# Altium project OPENFV 1.0.PrjPcb
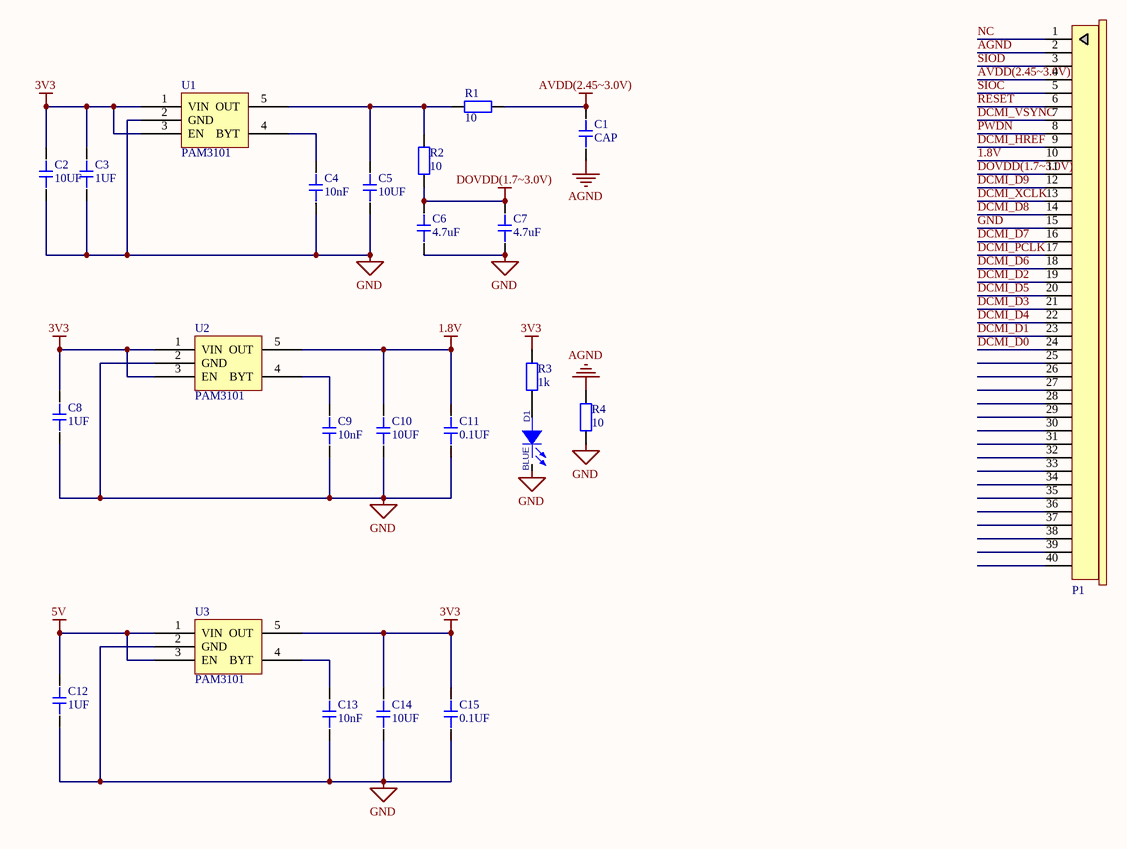
[diagram p0: ov7670电路（骑飞）.SchDoc]
2 sheets, 63 parts. Net scope: global (net labels, ports and power ports of the same name join across sheets).
Board file: 1.0.PcbDoc
Sheets:
  ov7670电路（骑飞）.SchDoc
  F407VET6（主控）.SchDoc

## Sheet ov7670电路（骑飞）.SchDoc
size A4

### Parts
C1  CAP  [C_0603]
C2  10UF  [C_0805]
C3  1UF  [C_0603]
C4  10nF  [C_0603]
C5  10UF  [C_0805]
C6  4.7uF  [C_0805]
C7  4.7uF  [C_0603]
C8  1UF  [C_0603]
C9  10nF  [C_0603]
C10  10UF  [C_0805]
C11  0.1UF  [C_0603]
C12  1UF  [C_0603]
C13  10nF  [C_0603]
C14  10UF  [C_0805]
C15  0.1UF  [C_0603]
D1  value BLUE  [LED_0603]  (hidden comment: LED)
P1  FPC  [FPC0.5-40P-A]  (value not drawn)
R1  value 10  [0603-1]  (hidden comment: Res1)
R2  value 10  [0603-1]  (hidden comment: Res1)
R3  value 1k  [0603-1]  (hidden comment: Res1)
R4  value 10  [0603-1]  (hidden comment: Res1)
U1  PAM3101  [SOT23-5]
U2  PAM3101  [SOT23-5]
U3  PAM3101  [SOT23-5]

### Nets
1.8V: C10.2 C11.2 P1.10 U2.5(OUT)
3V3: C2.2 C3.2 C8.2 C14.2 C15.2 R3.2 U1.1(VIN) U1.3(EN) U2.1(VIN) U2.3(EN) U3.5(OUT)
5V: C12.2 U3.1(VIN) U3.3(EN)
AGND: C1.1 P1.2 R4.2
AVDD(2.45~3.0V): C1.2 P1.4 R1.2
DOVDD(1.7~3.0V): C6.2 C7.2 P1.11 R2.1
GND: C2.1 C3.1 C4.1 C5.1 C6.1 C7.1 C8.1 C9.1 C10.1 C11.1 C12.1 C13.1 C14.1 C15.1 D1.2(CATHODE) P1.15 R4.1 U1.2(GND) U2.2(GND) U3.2(GND)
DCMI_D0: P1.24
DCMI_D1: P1.23
DCMI_D2: P1.19
DCMI_D3: P1.21
DCMI_D4: P1.22
DCMI_D5: P1.20
DCMI_D6: P1.18
DCMI_D7: P1.16
DCMI_D8: P1.14
DCMI_D9: P1.12
DCMI_HREF: P1.9
DCMI_PCLK: P1.17
DCMI_VSYNC: P1.7
DCMI_XCLK: P1.13
NC: P1.1
PWDN: P1.8
RESET: P1.6
SIOC: P1.5
SIOD: P1.3
NetC4_2: C4.2 U1.4(BYT)
NetC5_2: C5.2 R1.1 R2.2 U1.5(OUT)
NetC9_2: C9.2 U2.4(BYT)
NetC13_2: C13.2 U3.4(BYT)
NetD1_1: D1.1(ANODE) R3.1

Not connected (* = marked no-connect by the designer): P1 25 26 27 28 29 30 31 32 33 34 35 36 37 38 39 40

### Library data of the parts
C2-C15 = CAP
P1 = FPC-40P: FPC排线连接器
R1-R4 = Res1: 贴片电阻; Published: 8-Jun-2000; LatestRevisionDate: 17-Jul-2002; LatestRevisionNote: Re-released for DXP Platform.; PackageReference: AXIAL-0.4; Publisher: Altium Limited
U1-U3 = PAM3101: LDO
D1 = LED: PCB DECAL: LED_0603

## Sheet F407VET6（主控）.SchDoc
size A4
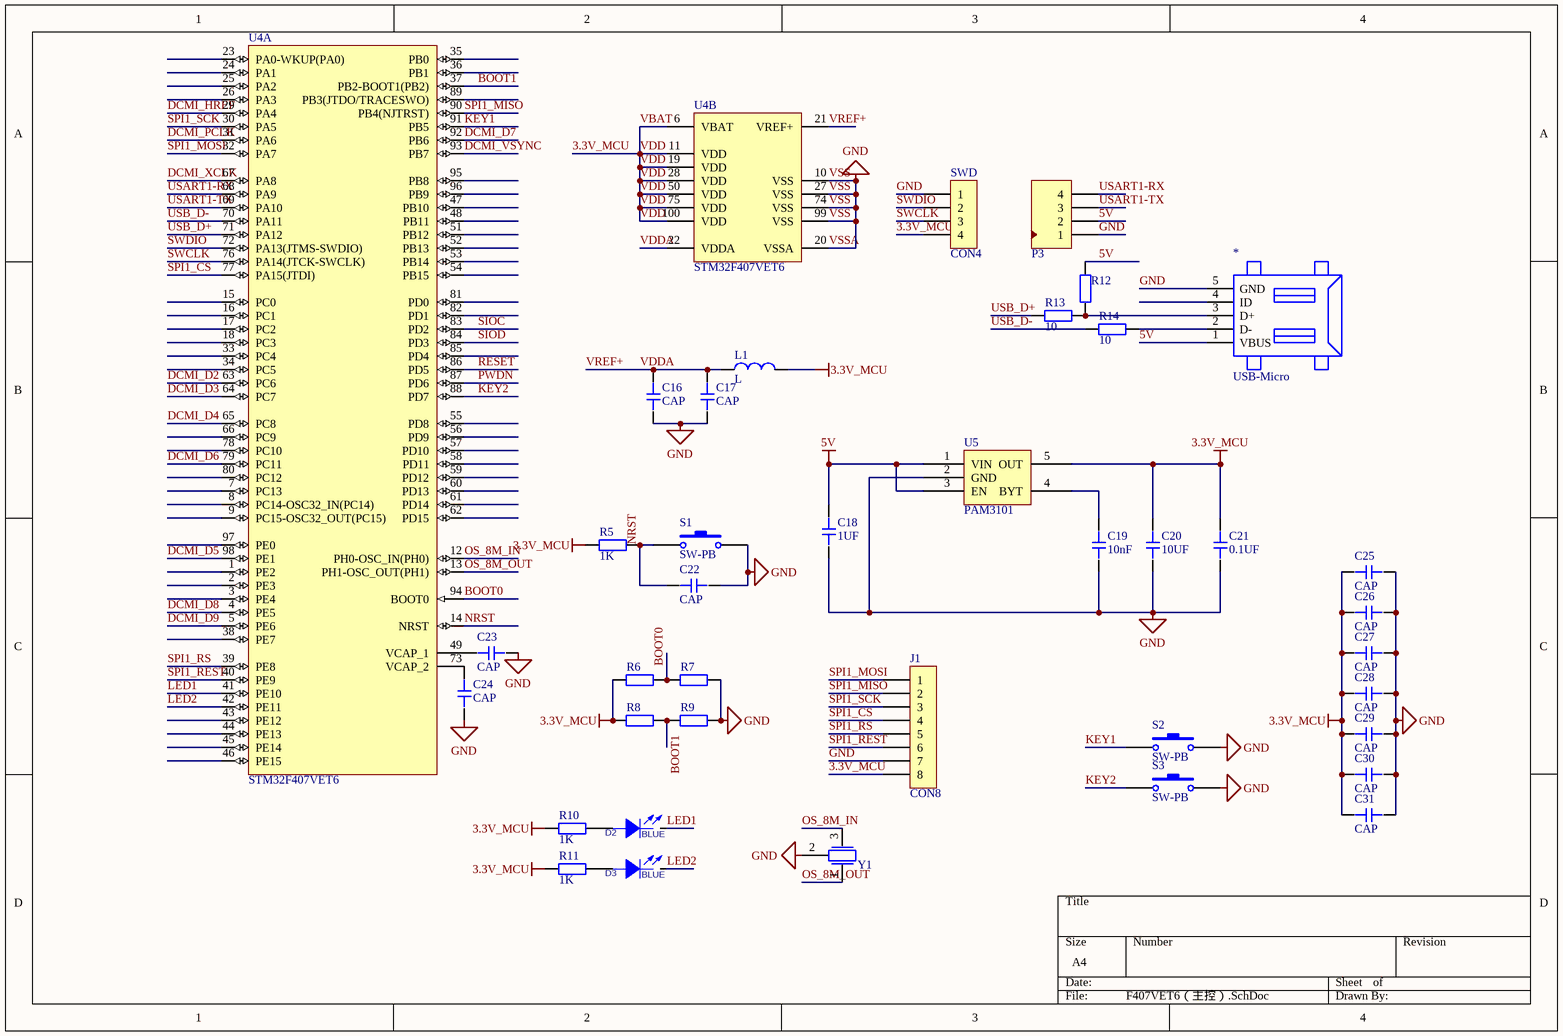
[diagram p1: F407VET6（主控）.SchDoc]

### Parts
*  USB-Micro  [USB-Micro]
C16  CAP  [C_0603]
C17  CAP  [C_0603]
C18  1UF  [C_0603]
C19  10nF  [C_0603]
C20  10UF  [C_0805]
C21  0.1UF  [C_0603]
C22  CAP  [C_0603]
C23  CAP  [C_0603]
C24  CAP  [C_0603]
C25  CAP  [C_0603]
C26  CAP  [C_0603]
C27  CAP  [C_0603]
C28  CAP  [C_0603]
C29  CAP  [C_0603]
C30  CAP  [C_0603]
C31  CAP  [C_0603]
D2  value BLUE  [LED_0603]  (hidden comment: LED)
D3  value BLUE  [LED_0603]  (hidden comment: LED)
J1  CON8  [sip-8]
L1  L  [L-0603]
P3  Header 4  [HDR4*1_SH1.0]  (value not drawn)
R5  value 1K  [0603-1]  (hidden comment: Res1)
R6  Res1  [0603-1]  (value not drawn)
R7  Res1  [0603-1]  (value not drawn)
R8  Res1  [0603-1]  (value not drawn)
R9  Res1  [0603-1]  (value not drawn)
R10  value 1K  [0603-1]  (hidden comment: Res1)
R11  value 1K  [0603-1]  (hidden comment: Res1)
R12  Res1  [0603-1]  (value not drawn)
R13  value 10  [0603-1]  (hidden comment: Res1)
R14  value 10  [0603-1]  (hidden comment: Res1)
S1  SW-PB  [Switch-PB-C-M]
S2  SW-PB  [Switch-PB-C-M]
S3  SW-PB  [Switch-PB-C-M]
SWD  CON4  [sip-4]
U4  STM32F407VET6  [STM-LQFP100_N]  (parts A,B of 2)
U5  PAM3101  [SOT23-5]
Y1  XTAL-3PIN  [X-CPX20]  (value not drawn)

### Nets
3.3V_MCU: C20.2 C21.2 C25.2 C26.2 C27.2 C28.2 C29.2 C30.2 C31.2 J1.8 L1.2 R5.1 R6.1 R8.1 R10.1 R11.1 SWD.4 U4.6(VBAT) U4.11(VDD) U4.19(VDD) U4.28(VDD) U4.50(VDD) U4.75(VDD) U4.100(VDD) U5.5(OUT)  [also labelled VBAT, VDD]
5V: *.1(VBUS) C18.2 P3.2 R12.2 U5.1(VIN) U5.3(EN)
GND: *.5(GND) C16.1 C17.1 C18.1 C19.1 C20.1 C21.1 C22.1 C23.1 C24.2 C25.1 C26.1 C27.1 C28.1 C29.1 C30.1 C31.1 J1.7 P3.1 R7.2 R9.2 S1.2 S2.2 S3.2 SWD.1 U4.10(VSS) U4.20(VSSA) U4.27(VSS) U4.74(VSS) U4.99(VSS) U5.2(GND) Y1.2  [also labelled VSS, VSSA]
BOOT0: R6.2 R7.1 U4.94(BOOT0)
BOOT1: R8.2 R9.1 U4.37(PB2-BOOT1(PB2))
DCMI_D2: U4.63(PC6)
DCMI_D3: U4.64(PC7)
DCMI_D4: U4.65(PC8)
DCMI_D5: U4.98(PE1)
DCMI_D6: U4.79(PC11)
DCMI_D7: U4.92(PB6)
DCMI_D8: U4.4(PE5)
DCMI_D9: U4.5(PE6)
DCMI_HREF: U4.29(PA4)
DCMI_PCLK: U4.31(PA6)
DCMI_VSYNC: U4.93(PB7)
DCMI_XCLK: U4.67(PA8)
KEY1: S2.1 U4.91(PB5)
KEY2: S3.1 U4.88(PD7)
LED1: D2.2(CATHODE) U4.41(PE10)
LED2: D3.2(CATHODE) U4.42(PE11)
NRST: C22.2 R5.2 S1.1 U4.14(NRST)
OS_8M_IN: U4.12(PH0-OSC_IN(PH0)) Y1.3
OS_8M_OUT: U4.13(PH1-OSC_OUT(PH1)) Y1.1
PWDN: U4.87(PD6)
RESET: U4.86(PD5)
SIOC: U4.83(PD2)
SIOD: U4.84(PD3)
SPI1_CS: J1.4 U4.77(PA15(JTDI))
SPI1_MISO: J1.2 U4.90(PB4(NJTRST))
SPI1_MOSI: J1.1 U4.32(PA7)
SPI1_REST: J1.6 U4.40(PE9)
SPI1_RS: J1.5 U4.39(PE8)
SPI1_SCK: J1.3 U4.30(PA5)
SWCLK: SWD.3 U4.76(PA14(JTCK-SWCLK))
SWDIO: SWD.2 U4.72(PA13(JTMS-SWDIO))
USART1-RX: P3.4 U4.68(PA9)
USART1-TX: P3.3 U4.69(PA10)
USB_D+: R13.1 U4.71(PA12)
USB_D-: R14.1 U4.70(PA11)
VDDA: C16.2 C17.2 L1.1 U4.21(VREF+) U4.22(VDDA)  [also labelled VREF+]
Net*_2: *.2(D-) R14.2
Net*_3: *.3(D+) R12.1 R13.2
NetC19_2: C19.2 U5.4(BYT)
NetC23_2: C23.2 U4.49(VCAP_1)
NetC24_1: C24.1 U4.73(VCAP_2)
NetD2_1: D2.1(ANODE) R10.2
NetD3_1: D3.1(ANODE) R11.2

Not connected (* = marked no-connect by the designer): * 4(ID); U4 1(PE2) 2(PE3) 3(PE4) 7(PC13) 8(PC14-OSC32_IN(PC14)) 9(PC15-OSC32_OUT(PC15)) 15(PC0) 16(PC1) 17(PC2) 18(PC3) 23(PA0-WKUP(PA0)) 24(PA1) 25(PA2) 26(PA3) 33(PC4) 34(PC5) 35(PB0) 36(PB1) 38(PE7) 43(PE12) 44(PE13) 45(PE14) 46(PE15) 47(PB10) 48(PB11) 51(PB12) 52(PB13) 53(PB14) 54(PB15) 55(PD8) 56(PD9) 57(PD10) 58(PD11) 59(PD12) 60(PD13) 61(PD14) 62(PD15) 66(PC9) 78(PC10) 80(PC12) 81(PD0) 82(PD1) 85(PD4) 89(PB3(JTDO/TRACESWO)) 95(PB8) 96(PB9) 97(PE0)

### Library data of the parts
C18-C21 = CAP
J1 = CON8: Connector
P3 = Header 4: 接插件; LatestRevisionDate: 17-Jul-2002; LatestRevisionNote: Re-released for DXP Platform.; Publisher: Altium Limited
R5-R14 = Res1: 贴片电阻; Published: 8-Jun-2000; LatestRevisionDate: 17-Jul-2002; LatestRevisionNote: Re-released for DXP Platform.; PackageReference: AXIAL-0.4; Publisher: Altium Limited
S1-S3 = SW-PB: Switch; Published: 24-Mar-1999; LatestRevisionDate: 17-Jul-2002; LatestRevisionNote: Re-released for DXP Platform.; PackageReference: SPST-2; Publisher: Altium Limited; PackageDescription: Switch; 2 Leads
SWD = CON4: Connector
U4 = STM32F407VET6: ARM Cortex-M4 32-bit MCU+FPU, 210 DMIPS, 512 kB Flash, 192 kB Internal RAM, 82 I/Os, 100-pin LQFP, -40 to 85 degC, Tray; Manufacturer: STMicroelectronics; D/A Converter: 2x12-bit; FLASH Size (Prog) (kB): 512; I/Os (High Current): 82; Internal RAM Size (kB): 192; Operating Frequency(F) (Processor speed) (MHz): 168; Supply Voltage(Vcc) max (V): 3.6; Supply Voltage(Vcc) min (V): 1.8; DatasheetVersion: Rev. 4; PackageVersion: Rev. 1, 06/2013; PackageReference: LQFP100; PackageDescription: 100-Pin Low Profile Quad Flat Package, 14 x 14 mm Body, 0.5 mm Pitch; Supplier 1: Digi-Key; Supplier Part Number 1: 497-12075-ND; Supplier 2: Farnell; Supplier Part Number 2: 2064367; Supplier 3: Newark; Supplier Part Number 3: 73T2332; Supplier 4: Mouser; Supplier Part Number 4: 511-STM32F407VET6; Core: ARM Cortex-M4; Packing: Tray; Mounting Technology: Surface Mount; PartNumber: STM32F407VET6; ComponentLink1Description: Manufacturer URL; ComponentLink1URL: http://www.st.com/web/en/home.html; ComponentLink2Description: Datasheet; ComponentLink2URL: http://www.st.com/st-web-ui/static/active/en/resource/technical/document/datasheet/DM00037051.pdf; ComponentLink3Description: Package Specification; ComponentLink3URL: http://www.st.com/st-web-ui/static/active/en/resource/technical/document/data_brief/DM00071938.pdf
U5 = PAM3101: LDO
Y1 = XTAL-3PIN: 贴片晶振
D2 D3 = LED: PCB DECAL: LED_0603

## Nets that join several sheets
5V: ov7670电路（骑飞） (C12.2 U3.1 U3.3), F407VET6（主控） (6 pins)
GND: ov7670电路（骑飞） (20 pins), F407VET6（主控） (32 pins)
DCMI_D2: ov7670电路（骑飞） (P1.19), F407VET6（主控） (U4.63)
DCMI_D3: ov7670电路（骑飞） (P1.21), F407VET6（主控） (U4.64)
DCMI_D4: ov7670电路（骑飞） (P1.22), F407VET6（主控） (U4.65)
DCMI_D5: ov7670电路（骑飞） (P1.20), F407VET6（主控） (U4.98)
DCMI_D6: ov7670电路（骑飞） (P1.18), F407VET6（主控） (U4.79)
DCMI_D7: ov7670电路（骑飞） (P1.16), F407VET6（主控） (U4.92)
DCMI_D8: ov7670电路（骑飞） (P1.14), F407VET6（主控） (U4.4)
DCMI_D9: ov7670电路（骑飞） (P1.12), F407VET6（主控） (U4.5)
DCMI_HREF: ov7670电路（骑飞） (P1.9), F407VET6（主控） (U4.29)
DCMI_PCLK: ov7670电路（骑飞） (P1.17), F407VET6（主控） (U4.31)
DCMI_VSYNC: ov7670电路（骑飞） (P1.7), F407VET6（主控） (U4.93)
DCMI_XCLK: ov7670电路（骑飞） (P1.13), F407VET6（主控） (U4.67)
PWDN: ov7670电路（骑飞） (P1.8), F407VET6（主控） (U4.87)
RESET: ov7670电路（骑飞） (P1.6), F407VET6（主控） (U4.86)
SIOC: ov7670电路（骑飞） (P1.5), F407VET6（主控） (U4.83)
SIOD: ov7670电路（骑飞） (P1.3), F407VET6（主控） (U4.84)